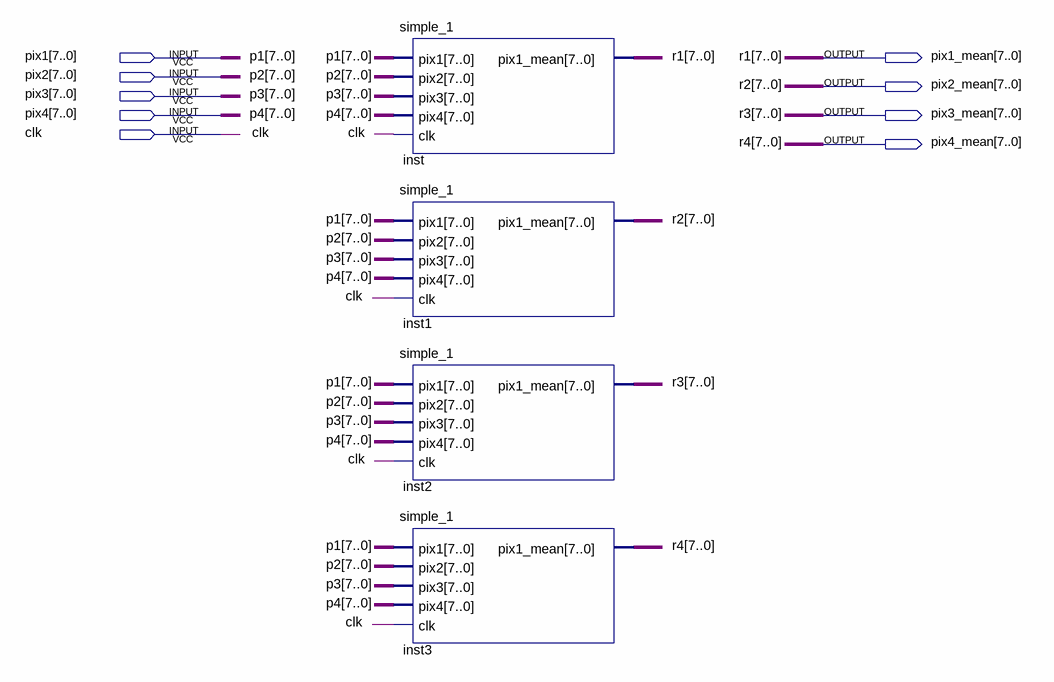
[diagram p0: schematic sheet]
// Quartus schematic simple_3.bdf as structural Verilog: 4 symbols, 9 pins
module simple_3 (
  input  [7:0] pix1,
  input  [7:0] pix2,
  input  [7:0] pix3,
  input  [7:0] pix4,
  input  clk,
  output [7:0] pix1_mean,
  output [7:0] pix2_mean,
  output [7:0] pix3_mean,
  output [7:0] pix4_mean
);

  simple_1 inst (.pix1(pix1), .pix2(pix2), .pix3(pix3), .pix4(pix4), .clk(clk), .pix1_mean(pix1_mean));
  simple_1 inst1 (.pix1(pix1), .pix2(pix2), .pix3(pix3), .pix4(pix4), .clk(clk), .pix1_mean(pix2_mean));
  simple_1 inst2 (.pix1(pix1), .pix2(pix2), .pix3(pix3), .pix4(pix4), .clk(clk), .pix1_mean(pix3_mean));
  simple_1 inst3 (.pix1(pix1), .pix2(pix2), .pix3(pix3), .pix4(pix4), .clk(clk), .pix1_mean(pix4_mean));

  // Other names for the same wires on the sheet: p1[7:0] = pix1; p2[7:0] = pix2; p3[7:0] = pix3; p4[7:0] = pix4;
  //   r1[7:0] = pix1_mean; r2[7:0] = pix2_mean; r3[7:0] = pix3_mean; r4[7:0] = pix4_mean
endmodule
